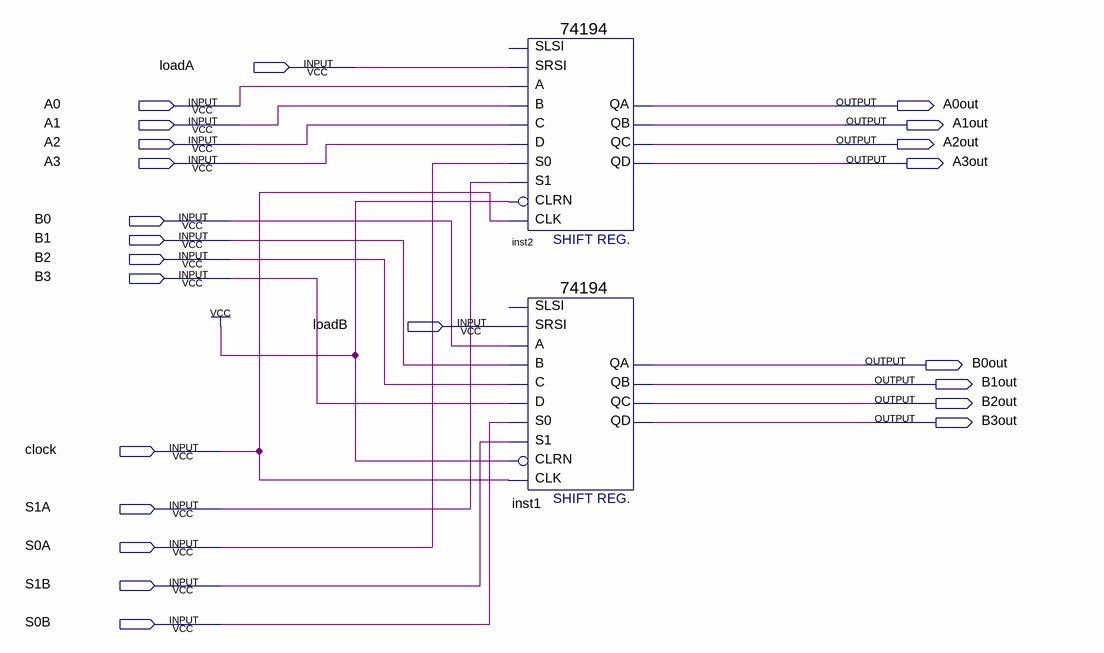
[diagram p0: schematic sheet]
// Quartus schematic memory.bdf as structural Verilog: 2 symbols, 23 pins
module memory (
  input  loadA,
  input  A0,
  input  A1,
  input  A2,
  input  A3,
  input  B0,
  input  B1,
  input  B2,
  input  B3,
  input  loadB,
  input  clock,
  input  S1A,
  input  S0A,
  input  S1B,
  input  S0B,
  output A0out,
  output A1out,
  output A2out,
  output A3out,
  output B0out,
  output B1out,
  output B2out,
  output B3out
);

  \74194  inst2 (
    .SRSI(loadA), .B(A1), .C(A2), .CLK(clock), .CLRN(1'b1), .D(A3), .S1(S1A), .S0(S0A), .A(A0), .QA(A0out),
    .QB(A1out), .QC(A2out), .QD(A3out));  // open: SLSI
  \74194  inst1 (
    .SRSI(loadB), .B(B1), .C(B2), .CLK(clock), .CLRN(1'b1), .D(B3), .S1(S1B), .S0(S0B), .A(B0), .QA(B0out),
    .QB(B1out), .QC(B2out), .QD(B3out));  // open: SLSI
endmodule
